# EAGLE schematic ALU (EAGLE 9.4.2)
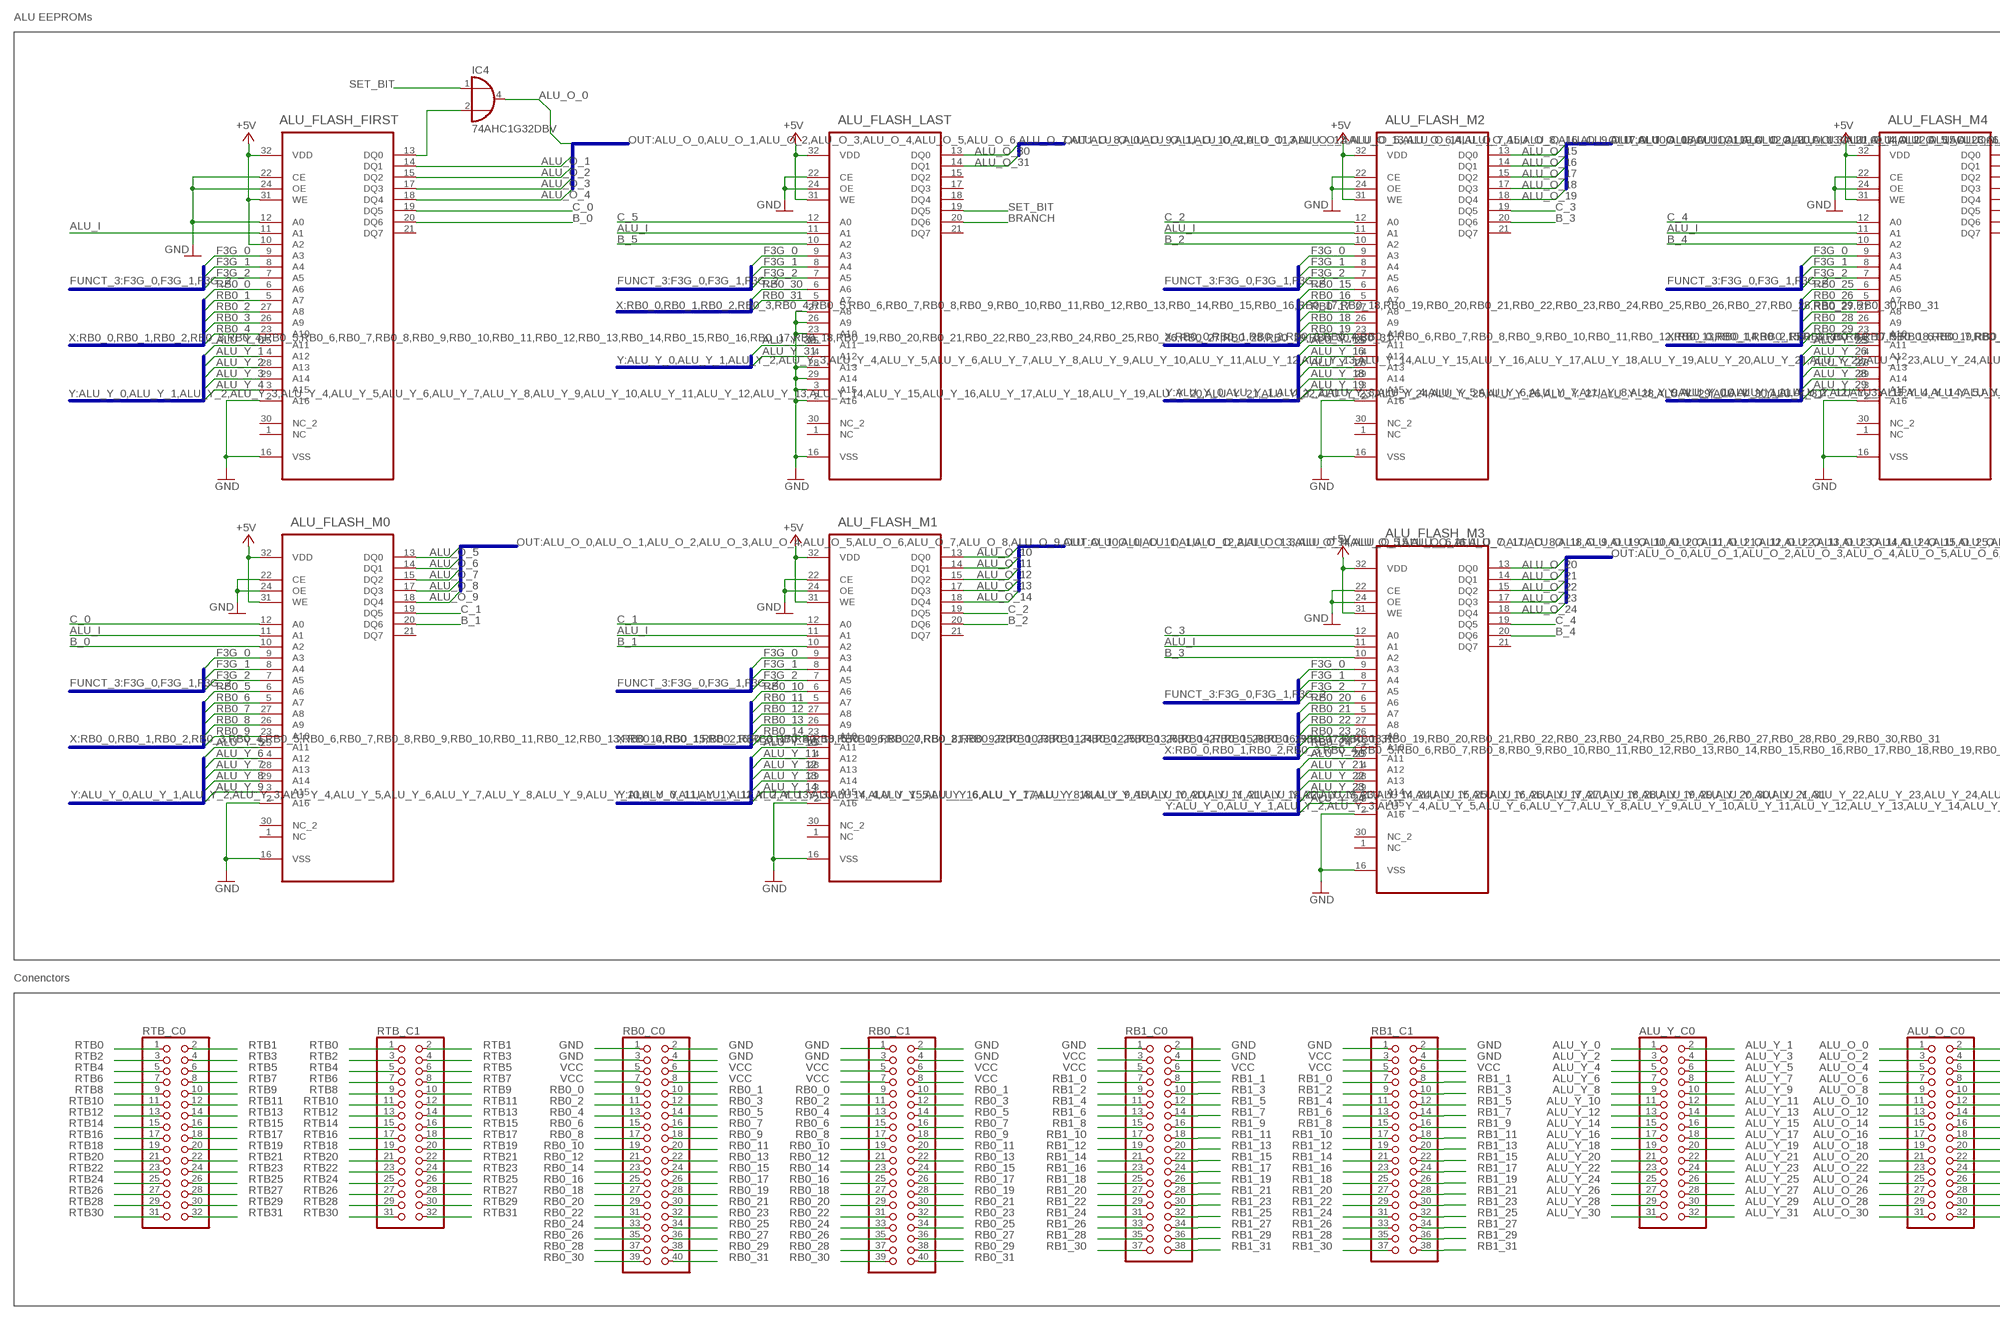
[diagram p0: schematic, sheet 1, part 1 of 2]
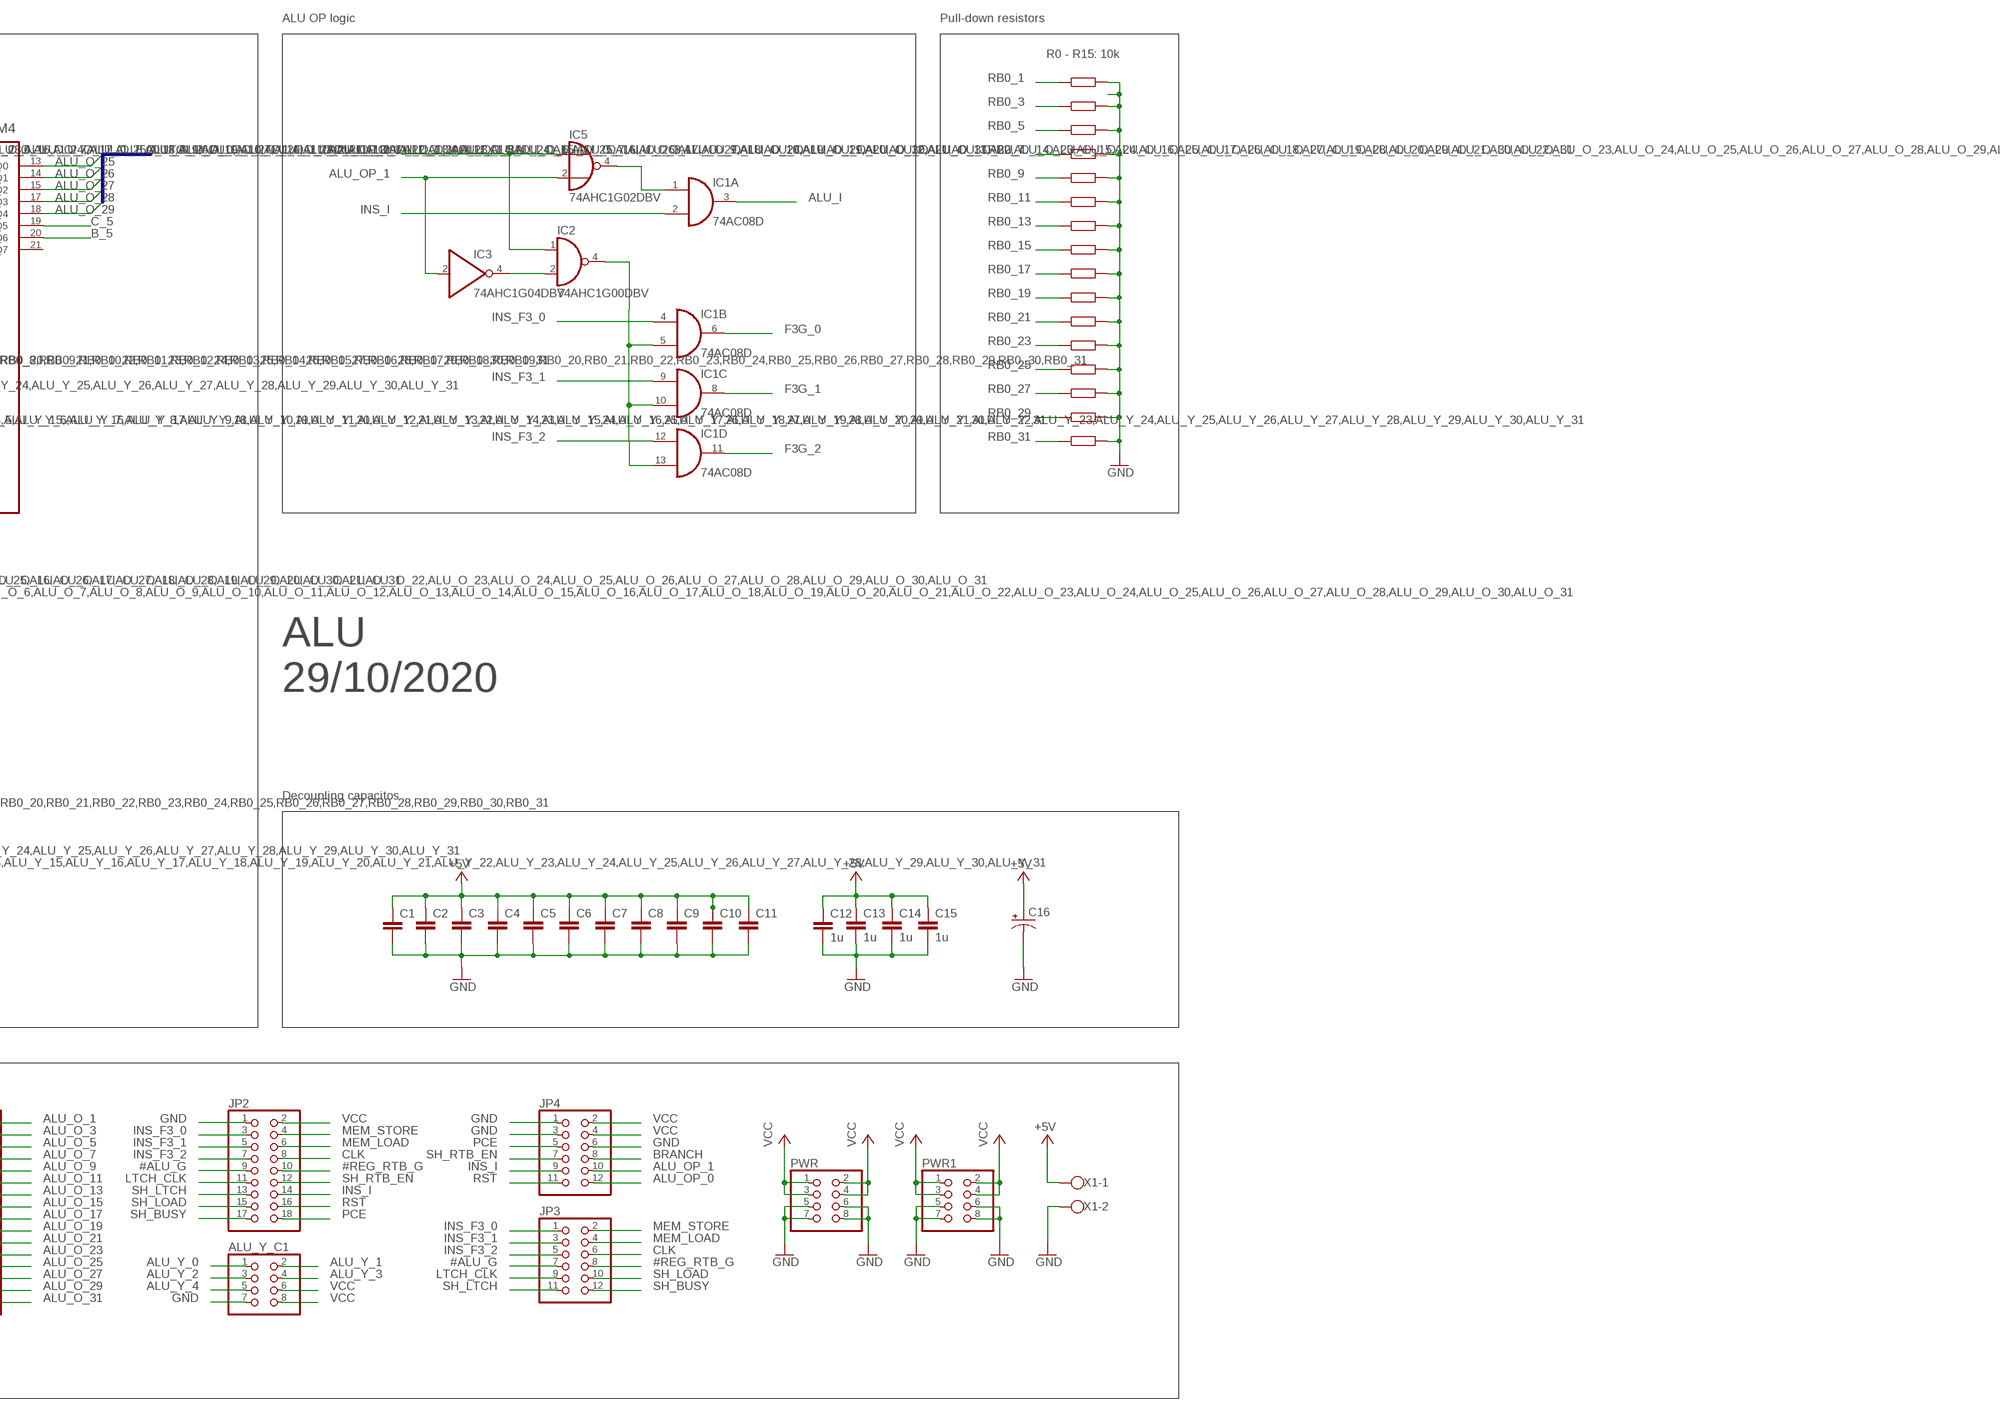
[diagram p1: schematic, sheet 1, part 2 of 2]

## Parts
ALU_FLASH_FIRST  SST39SF010A-70-4I-NHEPLCC32  [S32]
ALU_FLASH_LAST  SST39SF010A-70-4I-NHEPLCC32  [S32]
ALU_FLASH_M0  SST39SF010A-70-4I-NHEPLCC32  [S32]
ALU_FLASH_M1  SST39SF010A-70-4I-NHEPLCC32  [S32]
ALU_FLASH_M2  SST39SF010A-70-4I-NHEPLCC32  [S32]
ALU_FLASH_M3  SST39SF010A-70-4I-NHEPLCC32  [S32]
ALU_FLASH_M4  SST39SF010A-70-4I-NHEPLCC32  [S32]
ALU_O_C0  PINHD-2X16  [2X16]
ALU_Y_C0  PINHD-2X16  [2X16]
ALU_Y_C1  PINHD-2X4  [2X04]
C1  C-EUC0805  [C0805]
C2  C-EUC0805  [C0805]
C3  C-EUC0805  [C0805]
C4  C-EUC0805  [C0805]
C5  C-EUC0805  [C0805]
C6  C-EUC0805  [C0805]
C7  C-EUC0805  [C0805]
C8  C-EUC0805  [C0805]
C9  C-EUC0805  [C0805]
C10  C-EUC0805  [C0805]
C11  C-EUC0805  [C0805]
C12  1u  C-EUC0805  [C0805]
C13  1u  C-EUC0805  [C0805]
C14  1u  C-EUC0805  [C0805]
C15  1u  C-EUC0805  [C0805]
C16  CAPACITOR-P153CLV-1010  [153CLV-1010]
IC1  74AC08D  [SO14]
IC2  74AHC1G00DBV  [SOT23-5]
IC3  74AHC1G04DBV  [SOT23-5]
IC4  74AHC1G32DBV  [SOT23-5]
IC5  74AHC1G02DBV  [SOT23-5]
JP2  PINHD-2X9  [2X09]
JP3  PINHD-2X6  [2X06]
JP4  PINHD-2X6  [2X06]
PWR  PINHD-2X4  [2X04]
PWR1  PINHD-2X4  [2X04]
R0  R-EU_R0805  [R0805]
R1  R-EU_R0805  [R0805]
R2  R-EU_R0805  [R0805]
R3  R-EU_R0805  [R0805]
R4  R-EU_R0805  [R0805]
R5  R-EU_R0805  [R0805]
R6  R-EU_R0805  [R0805]
R7  R-EU_R0805  [R0805]
R8  R-EU_R0805  [R0805]
R9  R-EU_R0805  [R0805]
R10  R-EU_R0805  [R0805]
R11  R-EU_R0805  [R0805]
R12  R-EU_R0805  [R0805]
R13  R-EU_R0805  [R0805]
R14  R-EU_R0805  [R0805]
R15  R-EU_R0805  [R0805]
RB0_C0  PINHD-2X20  [2X20]
RB0_C1  PINHD-2X20  [2X20]
RB1_C0  PINHD-2X19  [2X19]
RB1_C1  PINHD-2X19  [2X19]
RTB_C0  PINHD-2X16  [2X16]
RTB_C1  PINHD-2X16  [2X16]
X1  W237-102  [W237-102]

## Nets
#ALU_G: JP2.9 JP3.7
#REG_RTB_G: JP2.10 JP3.8
ALU_I: ALU_FLASH_FIRST.11(A1) ALU_FLASH_LAST.11(A1) ALU_FLASH_M0.11(A1) ALU_FLASH_M1.11(A1) ALU_FLASH_M2.11(A1) ALU_FLASH_M3.11(A1) ALU_FLASH_M4.11(A1) IC1.3(A:O)
ALU_O_0: ALU_O_C0.1 IC4.4(O)
ALU_O_1: ALU_FLASH_FIRST.14(DQ1) ALU_O_C0.2
ALU_O_2: ALU_FLASH_FIRST.15(DQ2) ALU_O_C0.3
ALU_O_3: ALU_FLASH_FIRST.17(DQ3) ALU_O_C0.4
ALU_O_4: ALU_FLASH_FIRST.18(DQ4) ALU_O_C0.5
ALU_O_5: ALU_FLASH_M0.13(DQ0) ALU_O_C0.6
ALU_O_6: ALU_FLASH_M0.14(DQ1) ALU_O_C0.7
ALU_O_7: ALU_FLASH_M0.15(DQ2) ALU_O_C0.8
ALU_O_8: ALU_FLASH_M0.17(DQ3) ALU_O_C0.9
ALU_O_9: ALU_FLASH_M0.18(DQ4) ALU_O_C0.10
ALU_O_10: ALU_FLASH_M1.13(DQ0) ALU_O_C0.11
ALU_O_11: ALU_FLASH_M1.14(DQ1) ALU_O_C0.12
ALU_O_12: ALU_FLASH_M1.15(DQ2) ALU_O_C0.13
ALU_O_13: ALU_FLASH_M1.17(DQ3) ALU_O_C0.14
ALU_O_14: ALU_FLASH_M1.18(DQ4) ALU_O_C0.15
ALU_O_15: ALU_FLASH_M2.13(DQ0) ALU_O_C0.16
ALU_O_16: ALU_FLASH_M2.14(DQ1) ALU_O_C0.17
ALU_O_17: ALU_FLASH_M2.15(DQ2) ALU_O_C0.18
ALU_O_18: ALU_FLASH_M2.17(DQ3) ALU_O_C0.19
ALU_O_19: ALU_FLASH_M2.18(DQ4) ALU_O_C0.20
ALU_O_20: ALU_FLASH_M3.13(DQ0) ALU_O_C0.21
ALU_O_21: ALU_FLASH_M3.14(DQ1) ALU_O_C0.22
ALU_O_22: ALU_FLASH_M3.15(DQ2) ALU_O_C0.23
ALU_O_23: ALU_FLASH_M3.17(DQ3) ALU_O_C0.24
ALU_O_24: ALU_FLASH_M3.18(DQ4) ALU_O_C0.25
ALU_O_25: ALU_FLASH_M4.13(DQ0) ALU_O_C0.26
ALU_O_26: ALU_FLASH_M4.14(DQ1) ALU_O_C0.27
ALU_O_27: ALU_FLASH_M4.15(DQ2) ALU_O_C0.28
ALU_O_28: ALU_FLASH_M4.17(DQ3) ALU_O_C0.29
ALU_O_29: ALU_FLASH_M4.18(DQ4) ALU_O_C0.30
ALU_O_30: ALU_FLASH_LAST.13(DQ0) ALU_O_C0.31
ALU_O_31: ALU_FLASH_LAST.14(DQ1) ALU_O_C0.32
ALU_OP_0: IC2.1(I0) IC5.1(I0) JP4.12
ALU_OP_1: IC3.2(I) IC5.2(I1) JP4.10
ALU_Y_0: ALU_FLASH_FIRST.25(A11) ALU_Y_C0.1 ALU_Y_C1.1
ALU_Y_1: ALU_FLASH_FIRST.4(A12) ALU_Y_C0.2 ALU_Y_C1.2
ALU_Y_2: ALU_FLASH_FIRST.28(A13) ALU_Y_C0.3 ALU_Y_C1.3
ALU_Y_3: ALU_FLASH_FIRST.29(A14) ALU_Y_C0.4 ALU_Y_C1.4
ALU_Y_4: ALU_FLASH_FIRST.3(A15) ALU_Y_C0.5 ALU_Y_C1.5
ALU_Y_5: ALU_FLASH_M0.25(A11) ALU_Y_C0.6
ALU_Y_6: ALU_FLASH_M0.4(A12) ALU_Y_C0.7
ALU_Y_7: ALU_FLASH_M0.28(A13) ALU_Y_C0.8
ALU_Y_8: ALU_FLASH_M0.29(A14) ALU_Y_C0.9
ALU_Y_9: ALU_FLASH_M0.3(A15) ALU_Y_C0.10
ALU_Y_10: ALU_FLASH_M1.25(A11) ALU_Y_C0.11
ALU_Y_11: ALU_FLASH_M1.4(A12) ALU_Y_C0.12
ALU_Y_12: ALU_FLASH_M1.28(A13) ALU_Y_C0.13
ALU_Y_13: ALU_FLASH_M1.29(A14) ALU_Y_C0.14
ALU_Y_14: ALU_FLASH_M1.3(A15) ALU_Y_C0.15
ALU_Y_15: ALU_FLASH_M2.25(A11) ALU_Y_C0.16
ALU_Y_16: ALU_FLASH_M2.4(A12) ALU_Y_C0.17
ALU_Y_17: ALU_FLASH_M2.28(A13) ALU_Y_C0.18
ALU_Y_18: ALU_FLASH_M2.29(A14) ALU_Y_C0.19
ALU_Y_19: ALU_FLASH_M2.3(A15) ALU_Y_C0.20
ALU_Y_20: ALU_FLASH_M3.25(A11) ALU_Y_C0.21
ALU_Y_21: ALU_FLASH_M3.4(A12) ALU_Y_C0.22
ALU_Y_22: ALU_FLASH_M3.28(A13) ALU_Y_C0.23
ALU_Y_23: ALU_FLASH_M3.29(A14) ALU_Y_C0.24
ALU_Y_24: ALU_FLASH_M3.3(A15) ALU_Y_C0.25
ALU_Y_25: ALU_FLASH_M4.25(A11) ALU_Y_C0.26
ALU_Y_26: ALU_FLASH_M4.4(A12) ALU_Y_C0.27
ALU_Y_27: ALU_FLASH_M4.28(A13) ALU_Y_C0.28
ALU_Y_28: ALU_FLASH_M4.29(A14) ALU_Y_C0.29
ALU_Y_29: ALU_FLASH_M4.3(A15) ALU_Y_C0.30
ALU_Y_30: ALU_FLASH_LAST.25(A11) ALU_Y_C0.31
ALU_Y_31: ALU_FLASH_LAST.4(A12) ALU_Y_C0.32
B_0: ALU_FLASH_FIRST.20(DQ6) ALU_FLASH_M0.10(A2)
B_1: ALU_FLASH_M0.20(DQ6) ALU_FLASH_M1.10(A2)
B_2: ALU_FLASH_M1.20(DQ6) ALU_FLASH_M2.10(A2)
B_3: ALU_FLASH_M2.20(DQ6) ALU_FLASH_M3.10(A2)
B_4: ALU_FLASH_M3.20(DQ6) ALU_FLASH_M4.10(A2)
B_5: ALU_FLASH_LAST.10(A2) ALU_FLASH_M4.20(DQ6)
BRANCH: ALU_FLASH_LAST.20(DQ6) JP4.8
C_0: ALU_FLASH_FIRST.19(DQ5) ALU_FLASH_M0.12(A0)
C_1: ALU_FLASH_M0.19(DQ5) ALU_FLASH_M1.12(A0)
C_2: ALU_FLASH_M1.19(DQ5) ALU_FLASH_M2.12(A0)
C_3: ALU_FLASH_M2.19(DQ5) ALU_FLASH_M3.12(A0)
C_4: ALU_FLASH_M3.19(DQ5) ALU_FLASH_M4.12(A0)
C_5: ALU_FLASH_LAST.12(A0) ALU_FLASH_M4.19(DQ5)
CLK: JP2.8 JP3.6
F3G_0: ALU_FLASH_FIRST.9(A3) ALU_FLASH_LAST.9(A3) ALU_FLASH_M0.9(A3) ALU_FLASH_M1.9(A3) ALU_FLASH_M2.9(A3) ALU_FLASH_M3.9(A3) ALU_FLASH_M4.9(A3) IC1.6(B:O)
F3G_1: ALU_FLASH_FIRST.8(A4) ALU_FLASH_LAST.8(A4) ALU_FLASH_M0.8(A4) ALU_FLASH_M1.8(A4) ALU_FLASH_M2.8(A4) ALU_FLASH_M3.8(A4) ALU_FLASH_M4.8(A4) IC1.8(C:O)
F3G_2: ALU_FLASH_FIRST.7(A5) ALU_FLASH_LAST.7(A5) ALU_FLASH_M0.7(A5) ALU_FLASH_M1.7(A5) ALU_FLASH_M2.7(A5) ALU_FLASH_M3.7(A5) ALU_FLASH_M4.7(A5) IC1.11(D:O)
GND: ALU_FLASH_FIRST.2(A16) ALU_FLASH_FIRST.12(A0) ALU_FLASH_FIRST.16(VSS) ALU_FLASH_FIRST.22(CE) ALU_FLASH_FIRST.24(OE) ALU_FLASH_LAST.2(A16) ALU_FLASH_LAST.3(A15) ALU_FLASH_LAST.16(VSS) ALU_FLASH_LAST.22(CE) ALU_FLASH_LAST.23(A10) ALU_FLASH_LAST.24(OE) ALU_FLASH_LAST.26(A9) ALU_FLASH_LAST.27(A8) ALU_FLASH_LAST.28(A13) ALU_FLASH_LAST.29(A14) ALU_FLASH_M0.2(A16) ALU_FLASH_M0.16(VSS) ALU_FLASH_M0.22(CE) ALU_FLASH_M0.24(OE) ALU_FLASH_M1.2(A16) ALU_FLASH_M1.16(VSS) ALU_FLASH_M1.22(CE) ALU_FLASH_M1.24(OE) ALU_FLASH_M2.2(A16) ALU_FLASH_M2.16(VSS) ALU_FLASH_M2.22(CE) ALU_FLASH_M2.24(OE) ALU_FLASH_M3.2(A16) ALU_FLASH_M3.16(VSS) ALU_FLASH_M3.22(CE) ALU_FLASH_M3.24(OE) ALU_FLASH_M4.2(A16) ALU_FLASH_M4.16(VSS) ALU_FLASH_M4.22(CE) ALU_FLASH_M4.24(OE) ALU_Y_C1.7 C1.2 C2.2 C3.2 C4.2 C5.2 C6.2 C7.2 C8.2 C9.2 C10.2 C11.2 C12.2 C13.2 C14.2 C15.2 C16.- JP2.1 JP4.1 JP4.3 JP4.6 PWR1.5 PWR1.6 PWR1.7 PWR1.8 PWR.5 PWR.6 PWR.7 PWR.8 R0.2 R1.2 R2.2 R3.2 R4.2 R5.2 R6.2 R7.2 R8.2 R9.2 R10.2 R11.2 R12.2 R13.2 R14.2 R15.2 RB0_C0.1 RB0_C0.2 RB0_C0.3 RB0_C0.4 RB0_C1.1 RB0_C1.2 RB0_C1.3 RB0_C1.4 RB1_C0.1 RB1_C0.2 RB1_C0.4 RB1_C1.1 RB1_C1.2 RB1_C1.4 X1.2
INS_F3_0: IC1.4(B:I0) JP2.3 JP3.1
INS_F3_1: IC1.9(C:I0) JP2.5 JP3.3
INS_F3_2: IC1.12(D:I0) JP2.7 JP3.5
INS_I: IC1.2(A:I1) JP2.14 JP4.9
LTCH_CLK: JP2.11 JP3.9
MEM_LOAD: JP2.6 JP3.4
MEM_STORE: JP2.4 JP3.2
N$1: ALU_FLASH_FIRST.13(DQ0) IC4.2(I1)
N$2: IC1.5(B:I1) IC1.10(C:I1) IC1.13(D:I1) IC2.4(O)
N$3: IC2.2(I1) IC3.4(O)
N$6: IC1.1(A:I0) IC5.4(O)
PCE: JP2.18 JP4.5
RB0_0: ALU_FLASH_FIRST.6(A6) RB0_C0.9 RB0_C1.9
RB0_1: ALU_FLASH_FIRST.5(A7) R0.1 RB0_C0.10 RB0_C1.10
RB0_2: ALU_FLASH_FIRST.27(A8) RB0_C0.11 RB0_C1.11
RB0_3: ALU_FLASH_FIRST.26(A9) R1.1 RB0_C0.12 RB0_C1.12
RB0_4: ALU_FLASH_FIRST.23(A10) RB0_C0.13 RB0_C1.13
RB0_5: ALU_FLASH_M0.6(A6) R2.1 RB0_C0.14 RB0_C1.14
RB0_6: ALU_FLASH_M0.5(A7) RB0_C0.15 RB0_C1.15
RB0_7: ALU_FLASH_M0.27(A8) R3.1 RB0_C0.16 RB0_C1.16
RB0_8: ALU_FLASH_M0.26(A9) RB0_C0.17 RB0_C1.17
RB0_9: ALU_FLASH_M0.23(A10) R4.1 RB0_C0.18 RB0_C1.18
RB0_10: ALU_FLASH_M1.6(A6) RB0_C0.19 RB0_C1.19
RB0_11: ALU_FLASH_M1.5(A7) R5.1 RB0_C0.20 RB0_C1.20
RB0_12: ALU_FLASH_M1.27(A8) RB0_C0.21 RB0_C1.21
RB0_13: ALU_FLASH_M1.26(A9) R6.1 RB0_C0.22 RB0_C1.22
RB0_14: ALU_FLASH_M1.23(A10) RB0_C0.23 RB0_C1.23
RB0_15: ALU_FLASH_M2.6(A6) R7.1 RB0_C0.24 RB0_C1.24
RB0_16: ALU_FLASH_M2.5(A7) RB0_C0.25 RB0_C1.25
RB0_17: ALU_FLASH_M2.27(A8) R8.1 RB0_C0.26 RB0_C1.26
RB0_18: ALU_FLASH_M2.26(A9) RB0_C0.27 RB0_C1.27
RB0_19: ALU_FLASH_M2.23(A10) R9.1 RB0_C0.28 RB0_C1.28
RB0_20: ALU_FLASH_M3.6(A6) RB0_C0.29 RB0_C1.29
RB0_21: ALU_FLASH_M3.5(A7) R10.1 RB0_C0.30 RB0_C1.30
RB0_22: ALU_FLASH_M3.27(A8) RB0_C0.31 RB0_C1.31
RB0_23: ALU_FLASH_M3.26(A9) R11.1 RB0_C0.32 RB0_C1.32
RB0_24: ALU_FLASH_M3.23(A10) RB0_C0.33 RB0_C1.33
RB0_25: ALU_FLASH_M4.6(A6) R12.1 RB0_C0.34 RB0_C1.34
RB0_26: ALU_FLASH_M4.5(A7) RB0_C0.35 RB0_C1.35
RB0_27: ALU_FLASH_M4.27(A8) R13.1 RB0_C0.36 RB0_C1.36
RB0_28: ALU_FLASH_M4.26(A9) RB0_C0.37 RB0_C1.37
RB0_29: ALU_FLASH_M4.23(A10) R14.1 RB0_C0.38 RB0_C1.38
RB0_30: ALU_FLASH_LAST.6(A6) RB0_C0.39 RB0_C1.39
RB0_31: ALU_FLASH_LAST.5(A7) R15.1 RB0_C0.40 RB0_C1.40
RB1_0: RB1_C0.7 RB1_C1.7
RB1_1: RB1_C0.8 RB1_C1.8
RB1_2: RB1_C0.9 RB1_C1.9
RB1_3: RB1_C0.10 RB1_C1.10
RB1_4: RB1_C0.11 RB1_C1.11
RB1_5: RB1_C0.12 RB1_C1.12
RB1_6: RB1_C0.13 RB1_C1.13
RB1_7: RB1_C0.14 RB1_C1.14
RB1_8: RB1_C0.15 RB1_C1.15
RB1_9: RB1_C0.16 RB1_C1.16
RB1_10: RB1_C0.17 RB1_C1.17
RB1_11: RB1_C0.18 RB1_C1.18
RB1_12: RB1_C0.19 RB1_C1.19
RB1_13: RB1_C0.20 RB1_C1.20
RB1_14: RB1_C0.21 RB1_C1.21
RB1_15: RB1_C0.22 RB1_C1.22
RB1_16: RB1_C0.23 RB1_C1.23
RB1_17: RB1_C0.24 RB1_C1.24
RB1_18: RB1_C0.25 RB1_C1.25
RB1_19: RB1_C0.26 RB1_C1.26
RB1_20: RB1_C0.27 RB1_C1.27
RB1_21: RB1_C0.28 RB1_C1.28
RB1_22: RB1_C0.29 RB1_C1.29
RB1_23: RB1_C0.30 RB1_C1.30
RB1_24: RB1_C0.31 RB1_C1.31
RB1_25: RB1_C0.32 RB1_C1.32
RB1_26: RB1_C0.33 RB1_C1.33
RB1_27: RB1_C0.34 RB1_C1.34
RB1_28: RB1_C0.35 RB1_C1.35
RB1_29: RB1_C0.36 RB1_C1.36
RB1_30: RB1_C0.37 RB1_C1.37
RB1_31: RB1_C0.38 RB1_C1.38
RST: JP2.16 JP4.11
RTB0: RTB_C0.1 RTB_C1.1
RTB1: RTB_C0.2 RTB_C1.2
RTB2: RTB_C0.3 RTB_C1.3
RTB3: RTB_C0.4 RTB_C1.4
RTB4: RTB_C0.5 RTB_C1.5
RTB5: RTB_C0.6 RTB_C1.6
RTB6: RTB_C0.7 RTB_C1.7
RTB7: RTB_C0.8 RTB_C1.8
RTB8: RTB_C0.9 RTB_C1.9
RTB9: RTB_C0.10 RTB_C1.10
RTB10: RTB_C0.11 RTB_C1.11
RTB11: RTB_C0.12 RTB_C1.12
RTB12: RTB_C0.13 RTB_C1.13
RTB13: RTB_C0.14 RTB_C1.14
RTB14: RTB_C0.15 RTB_C1.15
RTB15: RTB_C0.16 RTB_C1.16
RTB16: RTB_C0.17 RTB_C1.17
RTB17: RTB_C0.18 RTB_C1.18
RTB18: RTB_C0.19 RTB_C1.19
RTB19: RTB_C0.20 RTB_C1.20
RTB20: RTB_C0.21 RTB_C1.21
RTB21: RTB_C0.22 RTB_C1.22
RTB22: RTB_C0.23 RTB_C1.23
RTB23: RTB_C0.24 RTB_C1.24
RTB24: RTB_C0.25 RTB_C1.25
RTB25: RTB_C0.26 RTB_C1.26
RTB26: RTB_C0.27 RTB_C1.27
RTB27: RTB_C0.28 RTB_C1.28
RTB28: RTB_C0.29 RTB_C1.29
RTB29: RTB_C0.30 RTB_C1.30
RTB30: RTB_C0.31 RTB_C1.31
RTB31: RTB_C0.32 RTB_C1.32
SET_BIT: ALU_FLASH_LAST.19(DQ5) IC4.1(I0)
SH_BUSY: JP2.17 JP3.12
SH_LOAD: JP2.15 JP3.10
SH_LTCH: JP2.13 JP3.11
SH_RTB_EN: JP2.12 JP4.7
VCC: ALU_FLASH_FIRST.10(A2) ALU_FLASH_FIRST.31(WE) ALU_FLASH_FIRST.32(VDD) ALU_FLASH_LAST.31(WE) ALU_FLASH_LAST.32(VDD) ALU_FLASH_M0.31(WE) ALU_FLASH_M0.32(VDD) ALU_FLASH_M1.31(WE) ALU_FLASH_M1.32(VDD) ALU_FLASH_M2.31(WE) ALU_FLASH_M2.32(VDD) ALU_FLASH_M3.31(WE) ALU_FLASH_M3.32(VDD) ALU_FLASH_M4.31(WE) ALU_FLASH_M4.32(VDD) ALU_Y_C1.6 ALU_Y_C1.8 C1.1 C2.1 C3.1 C4.1 C5.1 C6.1 C7.1 C8.1 C9.1 C10.1 C11.1 C12.1 C13.1 C14.1 C15.1 C16.+ JP2.2 JP4.2 JP4.4 PWR1.1 PWR1.2 PWR1.3 PWR1.4 PWR.1 PWR.2 PWR.3 PWR.4 RB0_C0.5 RB0_C0.6 RB0_C0.7 RB0_C0.8 RB0_C1.5 RB0_C1.6 RB0_C1.7 RB0_C1.8 RB1_C0.3 RB1_C0.5 RB1_C0.6 RB1_C1.3 RB1_C1.5 RB1_C1.6 X1.1 ; supply symbol labelled +5V
Unconnected: ALU_FLASH_FIRST.1(NC) ALU_FLASH_FIRST.21(DQ7) ALU_FLASH_FIRST.30(NC_2) ALU_FLASH_LAST.1(NC) ALU_FLASH_LAST.15(DQ2) ALU_FLASH_LAST.17(DQ3) ALU_FLASH_LAST.18(DQ4) ALU_FLASH_LAST.21(DQ7) ALU_FLASH_LAST.30(NC_2) ALU_FLASH_M0.1(NC) ALU_FLASH_M0.21(DQ7) ALU_FLASH_M0.30(NC_2) ALU_FLASH_M1.1(NC) ALU_FLASH_M1.21(DQ7) ALU_FLASH_M1.30(NC_2) ALU_FLASH_M2.1(NC) ALU_FLASH_M2.21(DQ7) ALU_FLASH_M2.30(NC_2) ALU_FLASH_M3.1(NC) ALU_FLASH_M3.21(DQ7) ALU_FLASH_M3.30(NC_2) ALU_FLASH_M4.1(NC) ALU_FLASH_M4.21(DQ7) ALU_FLASH_M4.30(NC_2)

## Buses
FUNCT_3:F3G_0,F3G_1,F3G_2
X:RB0_0,RB0_1,RB0_2,RB0_3,RB0_4,RB0_5,RB0_6,RB0_7,RB0_8,RB0_9,RB0_10,RB0_11,RB0_12,RB0_13,RB0_14,RB0_15,RB0_16,RB0_17,RB0_18,RB0_19,RB0_20,RB0_21,RB0_22,RB0_23,RB0_24,RB0_25,RB0_26,RB0_27,RB0_28,RB0_29,RB0_30,RB0_31
Y:ALU_Y_0,ALU_Y_1,ALU_Y_2,ALU_Y_3,ALU_Y_4,ALU_Y_5,ALU_Y_6,ALU_Y_7,ALU_Y_8,ALU_Y_9,ALU_Y_10,ALU_Y_11,ALU_Y_12,ALU_Y_13,ALU_Y_14,ALU_Y_15,ALU_Y_16,ALU_Y_17,ALU_Y_18,ALU_Y_19,ALU_Y_20,ALU_Y_21,ALU_Y_22,ALU_Y_23,ALU_Y_24,ALU_Y_25,ALU_Y_26,ALU_Y_27,ALU_Y_28,ALU_Y_29,ALU_Y_30,ALU_Y_31
OUT:ALU_O_0,ALU_O_1,ALU_O_2,ALU_O_3,ALU_O_4,ALU_O_5,ALU_O_6,ALU_O_7,ALU_O_8,ALU_O_9,ALU_O_10,ALU_O_11,ALU_O_12,ALU_O_13,ALU_O_14,ALU_O_15,ALU_O_16,ALU_O_17,ALU_O_18,ALU_O_19,ALU_O_20,ALU_O_21,ALU_O_22,ALU_O_23,ALU_O_24,ALU_O_25,ALU_O_26,ALU_O_27,ALU_O_28,ALU_O_29,ALU_O_30,ALU_O_31

## Notes on the sheet
- ALU EEPROMs | ALU OP logic | Pull-down resistors
- R0 - R15: 10k
- ALU
  29/10/2020
- Decoupling capacitos
- Conenctors

## Power pins joined to a net without a drawn wire
GND: IC1.7(P:GND) IC2.3(GND) IC3.3(GND) IC4.3(GND) IC5.3(GND)
VCC: IC1.14(P:VCC) IC2.5(VCC) IC3.5(VCC) IC4.5(VCC) IC5.5(VCC)

## Library data of the parts
ALU_FLASH_FIRST ALU_FLASH_LAST ALU_FLASH_M0 ALU_FLASH_M1-ALU_FLASH_M4 = SST39SF010A-70-4I-NHE:SST39SF010A-70-4I-NHE: 1MB Flash
ALU_O_C0 RTB_C0 = pinhead:PINHD-2X16: PIN HEADER
ALU_Y_C0 RTB_C1 = pinhead_bottom:PINHD-2X16: PIN HEADER
ALU_Y_C1 PWR = pinhead:PINHD-2X4: PIN HEADER
C1-C15 = rcl:C-EU: CAPACITOR, European symbol; SPICEPREFIX: C
C16 = BeagleBone_Blue_R3:CAPACITOR-P: POLARIZED CAPACITOR, American symbol
IC1 = AAA__74xx-eu:74*08: Quad 2-input AND gate
IC2 = 74xx-little-de:74*1G00: 2-input NAND gate
IC3 = 74xx-little-de:74*1G04: INVERTER Gate
IC4 = 74xx-little-de:74*1G32: 2-input OR gate
IC5 = 74xx-little-de:74*1G02: 2-input NOR gate
JP2 = pinhead:PINHD-2X9: PIN HEADER
JP3 JP4 = pinhead_bottom:PINHD-2X6: PIN HEADER
PWR1 = pinhead_bottom:PINHD-2X4: PIN HEADER
R0 R1-R15 = rcl:R-EU_: RESISTOR, European symbol; SPICEPREFIX: R
RB0_C0 = pinhead:PINHD-2X20: PIN HEADER
RB0_C1 = pinhead_bottom:PINHD-2X20: PIN HEADER
RB1_C0 = pinhead:PINHD-2X19: PIN HEADER
RB1_C1 = pinhead_bottom:PINHD-2X19: PIN HEADER
X1 = con-wago-500:W237-102: WAGO SCREW CLAMP; MPN: 237-102; OC_FARNELL: unknown; OC_NEWARK: 70K9898